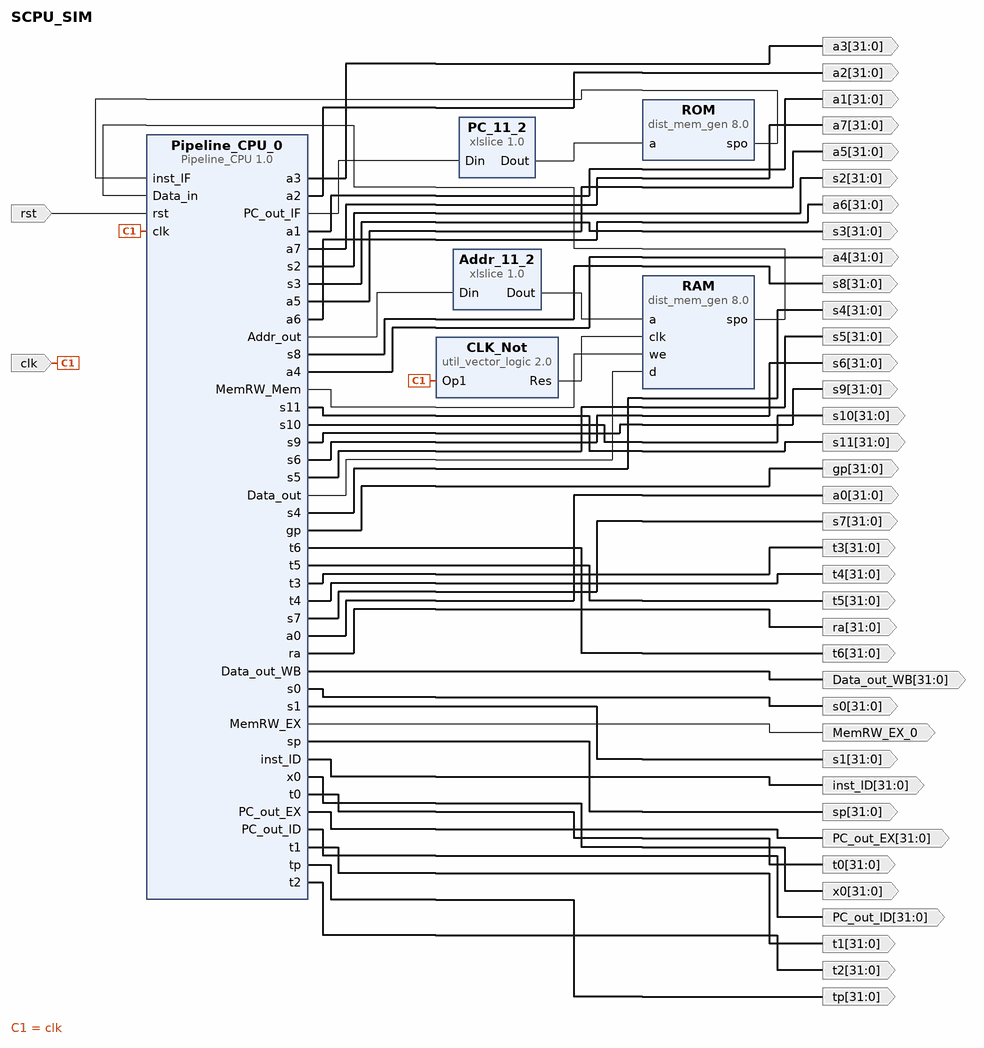
[diagram p0: block diagram of the top level]
# Vivado block design SCPU_SIM, xc7k160tffg676-2L, Vivado 2020.2
create_bd_design SCPU_SIM

create_bd_port -dir O -from 31 -to 0 a0
create_bd_port -dir O -from 31 -to 0 a1
create_bd_port -dir O -from 31 -to 0 a2
create_bd_port -dir O -from 31 -to 0 a3
create_bd_port -dir O -from 31 -to 0 a4
create_bd_port -dir O -from 31 -to 0 a5
create_bd_port -dir O -from 31 -to 0 a6
create_bd_port -dir O -from 31 -to 0 a7
create_bd_port -dir I -type clk clk
create_bd_port -dir O -from 31 -to 0 gp
create_bd_port -dir O -from 31 -to 0 ra
create_bd_port -dir I -type rst rst
set_property -dict {CONFIG.POLARITY ACTIVE_HIGH} [get_bd_ports rst]
create_bd_port -dir O -from 31 -to 0 s0
create_bd_port -dir O -from 31 -to 0 s1
create_bd_port -dir O -from 31 -to 0 s10
create_bd_port -dir O -from 31 -to 0 s11
create_bd_port -dir O -from 31 -to 0 s2
create_bd_port -dir O -from 31 -to 0 s3
create_bd_port -dir O -from 31 -to 0 s4
create_bd_port -dir O -from 31 -to 0 s5
create_bd_port -dir O -from 31 -to 0 s6
create_bd_port -dir O -from 31 -to 0 s7
create_bd_port -dir O -from 31 -to 0 s8
create_bd_port -dir O -from 31 -to 0 s9
create_bd_port -dir O -from 31 -to 0 sp
create_bd_port -dir O -from 31 -to 0 t0
create_bd_port -dir O -from 31 -to 0 t1
create_bd_port -dir O -from 31 -to 0 t2
create_bd_port -dir O -from 31 -to 0 t3
create_bd_port -dir O -from 31 -to 0 t4
create_bd_port -dir O -from 31 -to 0 t5
create_bd_port -dir O -from 31 -to 0 t6
create_bd_port -dir O -from 31 -to 0 tp
create_bd_port -dir O -from 31 -to 0 x0
create_bd_port -dir O -from 31 -to 0 Data_out_WB
create_bd_port -dir O MemRW_EX_0
create_bd_port -dir O -from 31 -to 0 PC_out_EX
create_bd_port -dir O -from 31 -to 0 PC_out_ID
create_bd_port -dir O -from 31 -to 0 inst_ID

create_bd_cell -type ip -vlnv xilinx.com:ip:xlslice:1.0 PC_11_2
set_property -dict {CONFIG.DIN_FROM 11 CONFIG.DIN_TO 2 CONFIG.DOUT_WIDTH 10} [get_bd_cells PC_11_2]
create_bd_cell -type ip -vlnv xilinx.com:ip:xlslice:1.0 Addr_11_2
set_property -dict {CONFIG.DIN_FROM 11 CONFIG.DIN_TO 2 CONFIG.DOUT_WIDTH 10} [get_bd_cells Addr_11_2]
create_bd_cell -type ip -vlnv xilinx.com:ip:util_vector_logic:2.0 CLK_Not
set_property -dict {CONFIG.C_OPERATION not CONFIG.C_SIZE 1} [get_bd_cells CLK_Not]
create_bd_cell -type ip -vlnv xilinx.com:ip:dist_mem_gen:8.0 ROM
set_property -dict [list \
  CONFIG.coefficient_file ../../../../../../COE_hazard/I_mem.coe \
  CONFIG.data_width 32 \
  CONFIG.depth 1024 \
  CONFIG.memory_type rom \
] [get_bd_cells ROM]
create_bd_cell -type ip -vlnv xilinx.com:ip:dist_mem_gen:8.0 RAM
set_property -dict [list \
  CONFIG.coefficient_file ../../../../../../COE/D_mem.coe \
  CONFIG.data_width 32 \
  CONFIG.depth 1024 \
  CONFIG.memory_type single_port_ram \
] [get_bd_cells RAM]
create_bd_cell -type ip -vlnv xilinx.com:user:Pipeline_CPU:1.0 Pipeline_CPU_0

# ---- connections ----

connect_bd_net [get_bd_pins PC_11_2/Dout] [get_bd_pins ROM/a]
connect_bd_net [get_bd_pins Addr_11_2/Dout] [get_bd_pins RAM/a]
connect_bd_net -net clk_0_1 [get_bd_ports clk] [get_bd_pins CLK_Not/Op1] [get_bd_pins Pipeline_CPU_0/clk]
connect_bd_net [get_bd_pins CLK_Not/Res] [get_bd_pins RAM/clk]
connect_bd_net [get_bd_pins Pipeline_CPU_0/t6] [get_bd_ports t6]
connect_bd_net [get_bd_pins Pipeline_CPU_0/t5] [get_bd_ports t5]
connect_bd_net [get_bd_pins Pipeline_CPU_0/t4] [get_bd_ports t4]
connect_bd_net [get_bd_pins Pipeline_CPU_0/t3] [get_bd_ports t3]
connect_bd_net [get_bd_pins Pipeline_CPU_0/s11] [get_bd_ports s11]
connect_bd_net [get_bd_pins Pipeline_CPU_0/s10] [get_bd_ports s10]
connect_bd_net [get_bd_pins Pipeline_CPU_0/s9] [get_bd_ports s9]
connect_bd_net [get_bd_pins Pipeline_CPU_0/s8] [get_bd_ports s8]
connect_bd_net [get_bd_pins Pipeline_CPU_0/s7] [get_bd_ports s7]
connect_bd_net [get_bd_pins Pipeline_CPU_0/s6] [get_bd_ports s6]
connect_bd_net [get_bd_pins Pipeline_CPU_0/s5] [get_bd_ports s5]
connect_bd_net [get_bd_pins Pipeline_CPU_0/s4] [get_bd_ports s4]
connect_bd_net [get_bd_pins Pipeline_CPU_0/s3] [get_bd_ports s3]
connect_bd_net [get_bd_pins Pipeline_CPU_0/s2] [get_bd_ports s2]
connect_bd_net [get_bd_pins Pipeline_CPU_0/a7] [get_bd_ports a7]
connect_bd_net [get_bd_pins Pipeline_CPU_0/a6] [get_bd_ports a6]
connect_bd_net [get_bd_pins Pipeline_CPU_0/a5] [get_bd_ports a5]
connect_bd_net [get_bd_pins Pipeline_CPU_0/a4] [get_bd_ports a4]
connect_bd_net [get_bd_pins Pipeline_CPU_0/a3] [get_bd_ports a3]
connect_bd_net [get_bd_pins Pipeline_CPU_0/a2] [get_bd_ports a2]
connect_bd_net [get_bd_pins Pipeline_CPU_0/a1] [get_bd_ports a1]
connect_bd_net [get_bd_pins Pipeline_CPU_0/x0] [get_bd_ports x0]
connect_bd_net [get_bd_pins Pipeline_CPU_0/ra] [get_bd_ports ra]
connect_bd_net [get_bd_pins Pipeline_CPU_0/sp] [get_bd_ports sp]
connect_bd_net [get_bd_pins Pipeline_CPU_0/gp] [get_bd_ports gp]
connect_bd_net [get_bd_pins Pipeline_CPU_0/tp] [get_bd_ports tp]
connect_bd_net [get_bd_pins Pipeline_CPU_0/t0] [get_bd_ports t0]
connect_bd_net [get_bd_pins Pipeline_CPU_0/t1] [get_bd_ports t1]
connect_bd_net [get_bd_pins Pipeline_CPU_0/t2] [get_bd_ports t2]
connect_bd_net [get_bd_pins Pipeline_CPU_0/s0] [get_bd_ports s0]
connect_bd_net [get_bd_pins Pipeline_CPU_0/s1] [get_bd_ports s1]
connect_bd_net [get_bd_pins Pipeline_CPU_0/a0] [get_bd_ports a0]
connect_bd_net [get_bd_pins ROM/spo] [get_bd_pins Pipeline_CPU_0/inst_IF]
connect_bd_net [get_bd_ports rst] [get_bd_pins Pipeline_CPU_0/rst]
connect_bd_net [get_bd_pins RAM/spo] [get_bd_pins Pipeline_CPU_0/Data_in]
connect_bd_net [get_bd_pins Pipeline_CPU_0/PC_out_IF] [get_bd_pins PC_11_2/Din]
connect_bd_net [get_bd_pins Pipeline_CPU_0/MemRW_Mem] [get_bd_pins RAM/we]
connect_bd_net [get_bd_pins Pipeline_CPU_0/Addr_out] [get_bd_pins Addr_11_2/Din]
connect_bd_net [get_bd_pins Pipeline_CPU_0/Data_out] [get_bd_pins RAM/d]
connect_bd_net [get_bd_pins Pipeline_CPU_0/Data_out_WB] [get_bd_ports Data_out_WB]
connect_bd_net [get_bd_pins Pipeline_CPU_0/MemRW_EX] [get_bd_ports MemRW_EX_0]
connect_bd_net [get_bd_pins Pipeline_CPU_0/PC_out_EX] [get_bd_ports PC_out_EX]
connect_bd_net [get_bd_pins Pipeline_CPU_0/PC_out_ID] [get_bd_ports PC_out_ID]
connect_bd_net [get_bd_pins Pipeline_CPU_0/inst_ID] [get_bd_ports inst_ID]

validate_bd_design
save_bd_design
